# Altium project EverySync_AD.PrjPcb
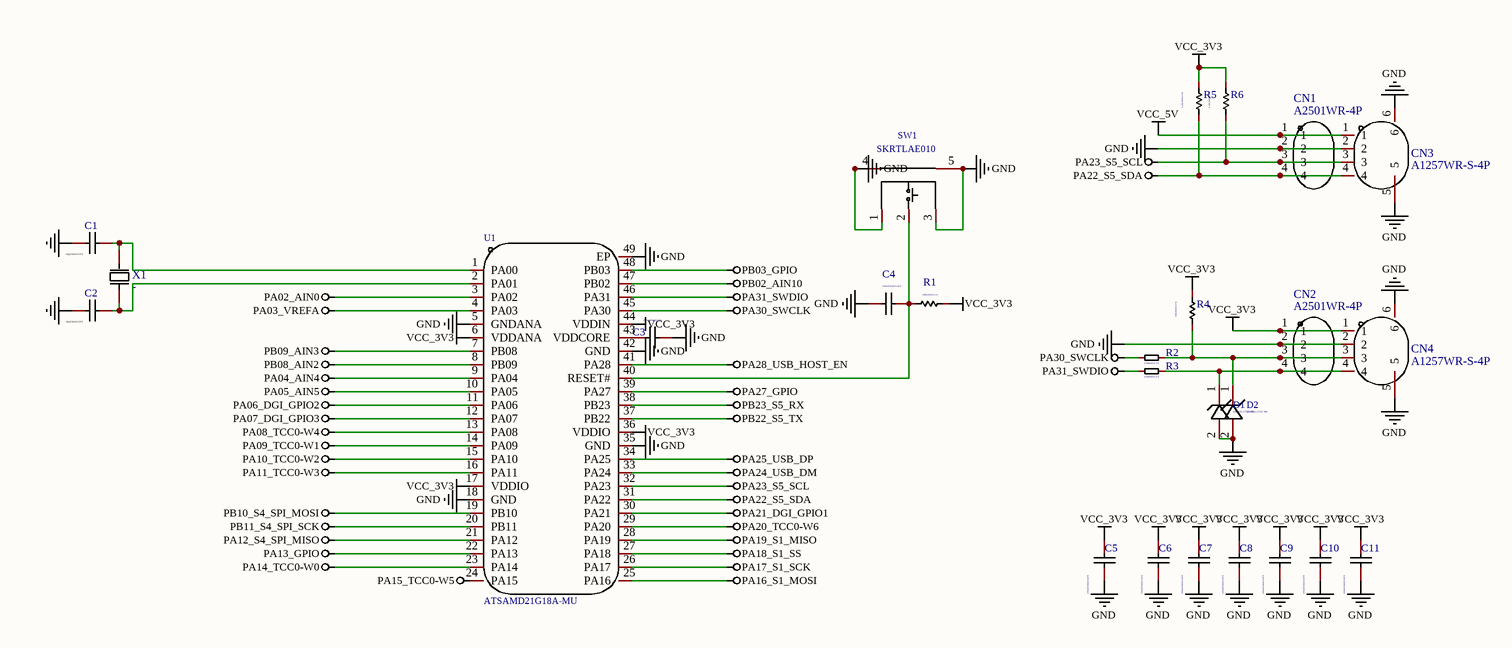
[diagram p0: 1_01 MCU.SchDoc.schdoc]
3 sheets, 155 parts. Net scope: flat (ports and power ports of the same name join across sheets).
Board file: EverySyncBoard.PcbDoc.pcbdoc
Sheets:
  1_01 MCU.SchDoc.schdoc
  2_02 Peripherals.SchDoc.schdoc
  3_03 Power.SchDoc.schdoc

## Sheet 1_01 MCU.SchDoc.schdoc
size 441 x 187 mm; Name: A_Customize; Symbol: A_Customize; Device: A_Customize; @Project Name: 01 MCU.SchDoc; REV: 1.0; Date: 2024-05-14; Sheet: 1/1; Draw By: TheConquerK; Company: NEU-REAL-LAB; Convert to PCB: yes; Add into BOM: yes; SheetNumber: 1; SheetTotal: 3

### Parts
C1  18pF/0402/50V  [C0402]  (value not drawn)
C2  18pF/0402/50V  [C0402]  (value not drawn)
C3  100nF/0603/50V  [C0402]
C4  100nF/0402/50V  [C0402]
C5  100nF/0603/50V  [C0402]
C6  100nF/0603/50V  [C0402]
C7  100nF/0603/50V  [C0402]
C8  100nF/0603/50V  [C0402]
C9  100nF/0603/50V  [C0402]
C10  100nF/0603/50V  [C0402]
C11  100nF/0603/50V  [C0402]
CN1  A2501WR-4P  [CONN-TH_A2501WR-4P]
CN2  A2501WR-4P  [CONN-TH_A2501WR-4P]
CN3  A1257WR-S-4P  [CONN-SMD_A1257WR-S-4P]
CN4  A1257WR-S-4P  [CONN-SMD_A1257WR-S-4P]
D1  ESD5Z3.3T1G-MS  [SOD-523]
D2  ESD5Z3.3T1G-MS  [SOD-523]
R1  10K/0402/1%  [R0402]
R2  22R/0402/1%  [R0402]
R3  22R/0402/1%  [R0402]
R4  10K/0402/1%  [R0402]
R5  2.2K/0402/1%  [R0402]
R6  2.2K/0402/1%  [R0402]
SW1  SKRTLAE010  [KEY-SMD_SKRTLAE010]
U1  ATSAMD21G18A-MU  [QFN-48_L7.0-W7.0-P0.50-TL-EP5.1]
X1  -  [OSC-SMD_L3.2-W1.5]

### Nets
GND: C1.2 C2.2 C3.2 C4.1 C5.2 C6.2 C7.2 C8.2 C9.2 C10.2 C11.2 CN1.2 CN2.2 CN3.2 CN3.5 CN3.6 CN4.2 CN4.5 CN4.6 D1.2(A) D2.2(A) SW1.1 SW1.3 SW1.4 SW1.5 U1.5(GNDANA) U1.18(GND) U1.35(GND) U1.42(GND) U1.49(EP)
PA02_AIN0: U1.3(PA02)
PA03_VREFA: U1.4(PA03)
PA04_AIN4: U1.9(PA04)
PA05_AIN5: U1.10(PA05)
PA06_DGI_GPIO2: U1.11(PA06)
PA07_DGI_GPIO3: U1.12(PA07)
PA08_TCC0-W4: U1.13(PA08)
PA09_TCC0-W1: U1.14(PA09)
PA10_TCC0-W2: U1.15(PA10)
PA11_TCC0-W3: U1.16(PA11)
PA12_S4_SPI_MISO: U1.21(PA12)
PA13_GPIO: U1.22(PA13)
PA14_TCC0-W0: U1.23(PA14)
PA15_TCC0-W5: U1.24(PA15)  [project net #EXPC1]
PA16_S1_MOSI: U1.25(PA16)
PA17_S1_SCK: U1.26(PA17)
PA18_S1_SS: U1.27(PA18)
PA19_S1_MISO: U1.28(PA19)
PA20_TCC0-W6: U1.29(PA20)  [project net #EXPC2]
PA21_DGI_GPIO1: U1.30(PA21)  [project net #EXPC3]
PA22_S5_SDA: CN1.4 CN3.4 R5.1 U1.31(PA22)
PA23_S5_SCL: CN1.3 CN3.3 R6.1 U1.32(PA23)
PA24_USB_DM: U1.33(PA24)
PA25_USB_DP: U1.34(PA25)
PA27_GPIO: U1.39(PA27)
PA28_USB_HOST_EN: U1.41(PA28)
PA30_SWCLK: R2.1 U1.45(PA30)
PA31_SWDIO: R3.1 U1.46(PA31)
PB02_AIN10: U1.47(PB02)
PB03_GPIO: U1.48(PB03)
PB08_AIN2: U1.8(PB09)
PB09_AIN3: U1.7(PB08)
PB10_S4_SPI_MOSI: U1.19(PB10)
PB11_S4_SPI_SCK: U1.20(PB11)
PB22_S5_TX: U1.37(PB22)
PB23_S5_RX: U1.38(PB23)
VCC_3V3: C5.1 C6.1 C7.1 C8.1 C9.1 C10.1 C11.1 CN2.1 CN4.1 R1.2 R4.2 R5.2 R6.2 U1.6(VDDANA) U1.17(VDDIO) U1.36(VDDIO) U1.44(VDDIN)
VCC_5V: CN1.1 CN3.1
NetC1_1: C1.1 U1.1(PA00) X1.2(OSC2)
NetC2_1: C2.1 U1.2(PA01) X1.1(OSC1)
NetC3_1: C3.1 U1.43(VDDCORE)
NetC4_2: C4.2 R1.1 SW1.2 U1.40(RESET#)
NetCN2_3: CN2.3 CN4.3 D2.1(C) R2.2 R4.1
NetCN2_4: CN2.4 CN4.4 D1.1(C) R3.2

### Notes on the sheet
- 1
- 2
- 3
- 4
- 5
- A
- B
- TITLE:
- 01 MCU.SchDoc
- REV:
- 1.0
- Date:
- Company:
- 2024-05-14
- NEU-REAL-LAB
- Drawn By:
- TheConquerK
- Sheet:
- 1/1

### Library data of the parts
C1 C2 = 18pF/0402/50V: Convert to PCB: yes; Name: 18pF/0402/50V; Symbol: 18pF/0402/50V; Device: 18pF/0402/50V; Published: 8-Jun-2000; LatestRevisionDate: 17-Jul-2002; LatestRevisionNote: Re-released for DXP Platform.; PackageReference: RAD-0.3; Publisher: Altium Limited; PackageDescription: Radial Cap, Thru-Hole; 2 Leads; 0.3 in Pin Spacing; Add into BOM: yes; Origin Footprint: C0402
C3 C5-C11 = 100nF/0603/50V: Convert to PCB: yes; Name: 100nF/0603/50V; Symbol: 100nF/0603/50V; Device: 100nF/0603/50V; Published: 8-Jun-2000; LatestRevisionDate: 17-Jul-2002; LatestRevisionNote: Re-released for DXP Platform.; PackageReference: RAD-0.3; Publisher: Altium Limited; PackageDescription: Radial Cap, Thru-Hole; 2 Leads; 0.3 in Pin Spacing; Add into BOM: yes; Origin Footprint: C0402
C4 = 100nF/0402/50V: Convert to PCB: yes; Name: 100nF/0402/50V; Symbol: 100nF/0402/50V; Device: 100nF/0402/50V; Published: 8-Jun-2000; LatestRevisionDate: 17-Jul-2002; LatestRevisionNote: Re-released for DXP Platform.; PackageReference: RAD-0.3; Publisher: Altium Limited; PackageDescription: Radial Cap, Thru-Hole; 2 Leads; 0.3 in Pin Spacing; Add into BOM: yes; Origin Footprint: C0402
CN1 CN2 = A2501WR-4P: Manufacturer: CJT(长江连接器); Convert to PCB: yes; Name: A2501WR-4P; Symbol: A2501WR-4P; Device: A2501WR-4P; Supplier: LCSC; Supplier Part: C225401; Manufacturer Part: A2501WR-4P; JLCPCB Part Class: Extended Part; Add into BOM: yes; Origin Footprint: CONN-TH_A2501WR-4P
CN3 CN4 = A1257WR-S-4P: Manufacturer: CJT(长江连接器); Convert to PCB: yes; Name: A1257WR-S-4P; Symbol: A1257WR-S-4P; Device: A1257WR-S-4P; Supplier: LCSC; Supplier Part: C225127; Manufacturer Part: A1257WR-S-4P; JLCPCB Part Class: Extended Part; Add into BOM: yes; Origin Footprint: CONN-SMD_A1257WR-S-4P
D1 D2 = ESD5Z3.3T1G-MS: Manufacturer: MDD（Microdiode Electronics）; Manufacturer Part: ESD5Z5V0; Convert to PCB: yes; Name: ESD5Z3.3T1G-MS; Symbol: ESD5Z3.3T1G-MS; Device: ESD5Z3.3T1G-MS; Supplier: LCSC; Supplier Part: C502546; JLCPCB Part Class: Extended Part; Add into BOM: yes; Origin Footprint: SOD-523
R1 R4 = 10K/0402/1%: Convert to PCB: yes; Name: 10K/0402/1%; Symbol: 10K/0402/1%; Device: 10K/0402/1%; Published: 8-Jun-2000; LatestRevisionDate: 17-Jul-2002; LatestRevisionNote: Re-released for DXP Platform.; PackageReference: AXIAL-0.5; Publisher: Altium Limited; PackageDescription: Axial Device, Thru-Hole; 2 Leads; 0.5 in Pin Spacing; Add into BOM: yes; Origin Footprint: R0402
R2 R3 = 22R/0402/1%: Convert to PCB: yes; Name: 22R/0402/1%; Symbol: 22R/0402/1%; Device: 22R/0402/1%; Add into BOM: yes; Origin Footprint: R0402
R5 R6 = 2.2K/0402/1%: Convert to PCB: yes; Name: 2.2K/0402/1%; Symbol: 2.2K/0402/1%; Device: 2.2K/0402/1%; Published: 8-Jun-2000; LatestRevisionDate: 17-Jul-2002; LatestRevisionNote: Re-released for DXP Platform.; PackageReference: AXIAL-0.5; Publisher: Altium Limited; PackageDescription: Axial Device, Thru-Hole; 2 Leads; 0.5 in Pin Spacing; Add into BOM: yes; Origin Footprint: R0402
SW1 = SKRTLAE010: Manufacturer: ALPS; Convert to PCB: yes; Name: SKRTLAE010; Symbol: SKRTLAE010; Device: SKRTLAE010; Supplier: LCSC; Manufacturer Part: SKRTLAE010; Supplier Part: C110293; JLCPCB Part Class: Extended Part; Add into BOM: yes; Origin Footprint: KEY-SMD_SKRTLAE010
U1 = ATSAMD21G18A-MU: Manufacturer: MICROCHIP(美国微芯); Convert to PCB: yes; Name: ATSAMD21G18A-MU; Symbol: ATSAMD21G18A-MU; Device: ATSAMD21G18A-MU; Supplier: LCSC; Supplier Part: C966903; Manufacturer Part: ATSAMD21G18A-MU; JLCPCB Part Class: Extended Part; Add into BOM: yes; Origin Footprint: QFN-48_L7.0-W7.0-P0.50-TL-EP5.1
X1 = -: Manufacturer: KDS(大真空); Manufacturer Part: DST310S 32.768KHz; Convert to PCB: yes; Name: -; Symbol: -; Device: -; Supplier: LCSC; Supplier Part: C93232; JLCPCB Part Class: Extended Part; Add into BOM: yes; Origin Footprint: OSC-SMD_L3.2-W1.5

## Sheet 2_02 Peripherals.SchDoc.schdoc
size 858 x 289 mm; Name: A_Customize; Symbol: A_Customize; Device: A_Customize; @Project Name: 02 Peripherals.SchDoc; REV: 1.0; Date: 2024-05-14; Sheet: 1/1; Draw By: TheConquerK; Company: NEU-REAL-LAB; Convert to PCB: yes; Add into BOM: yes
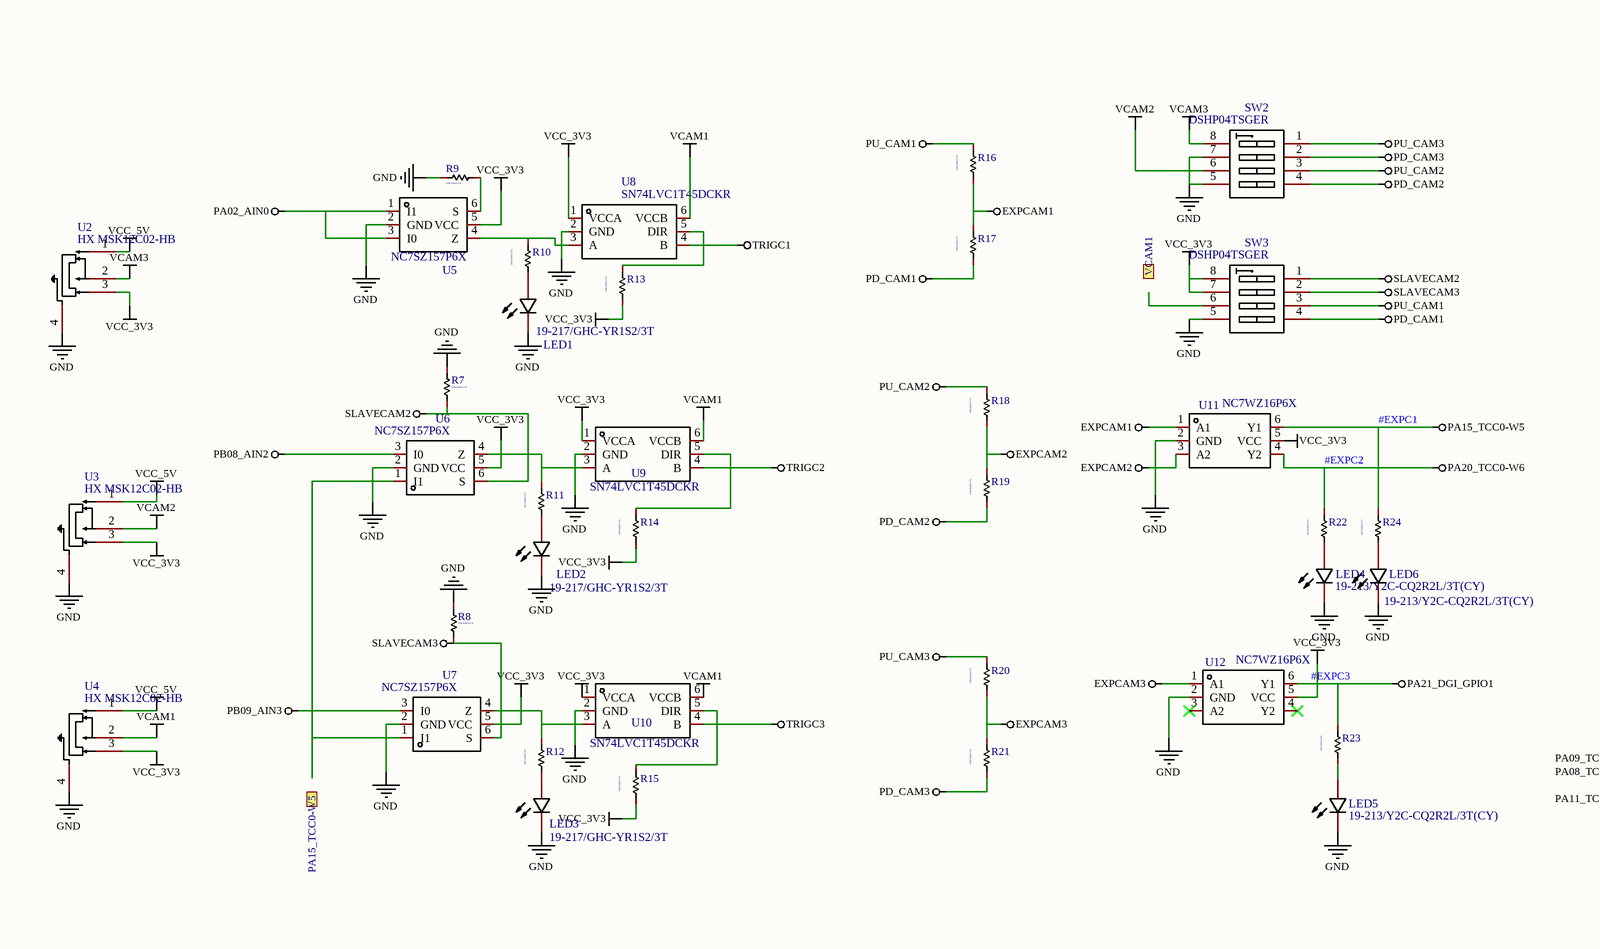
[diagram p1: 2_02 Peripherals.SchDoc.schdoc, left]
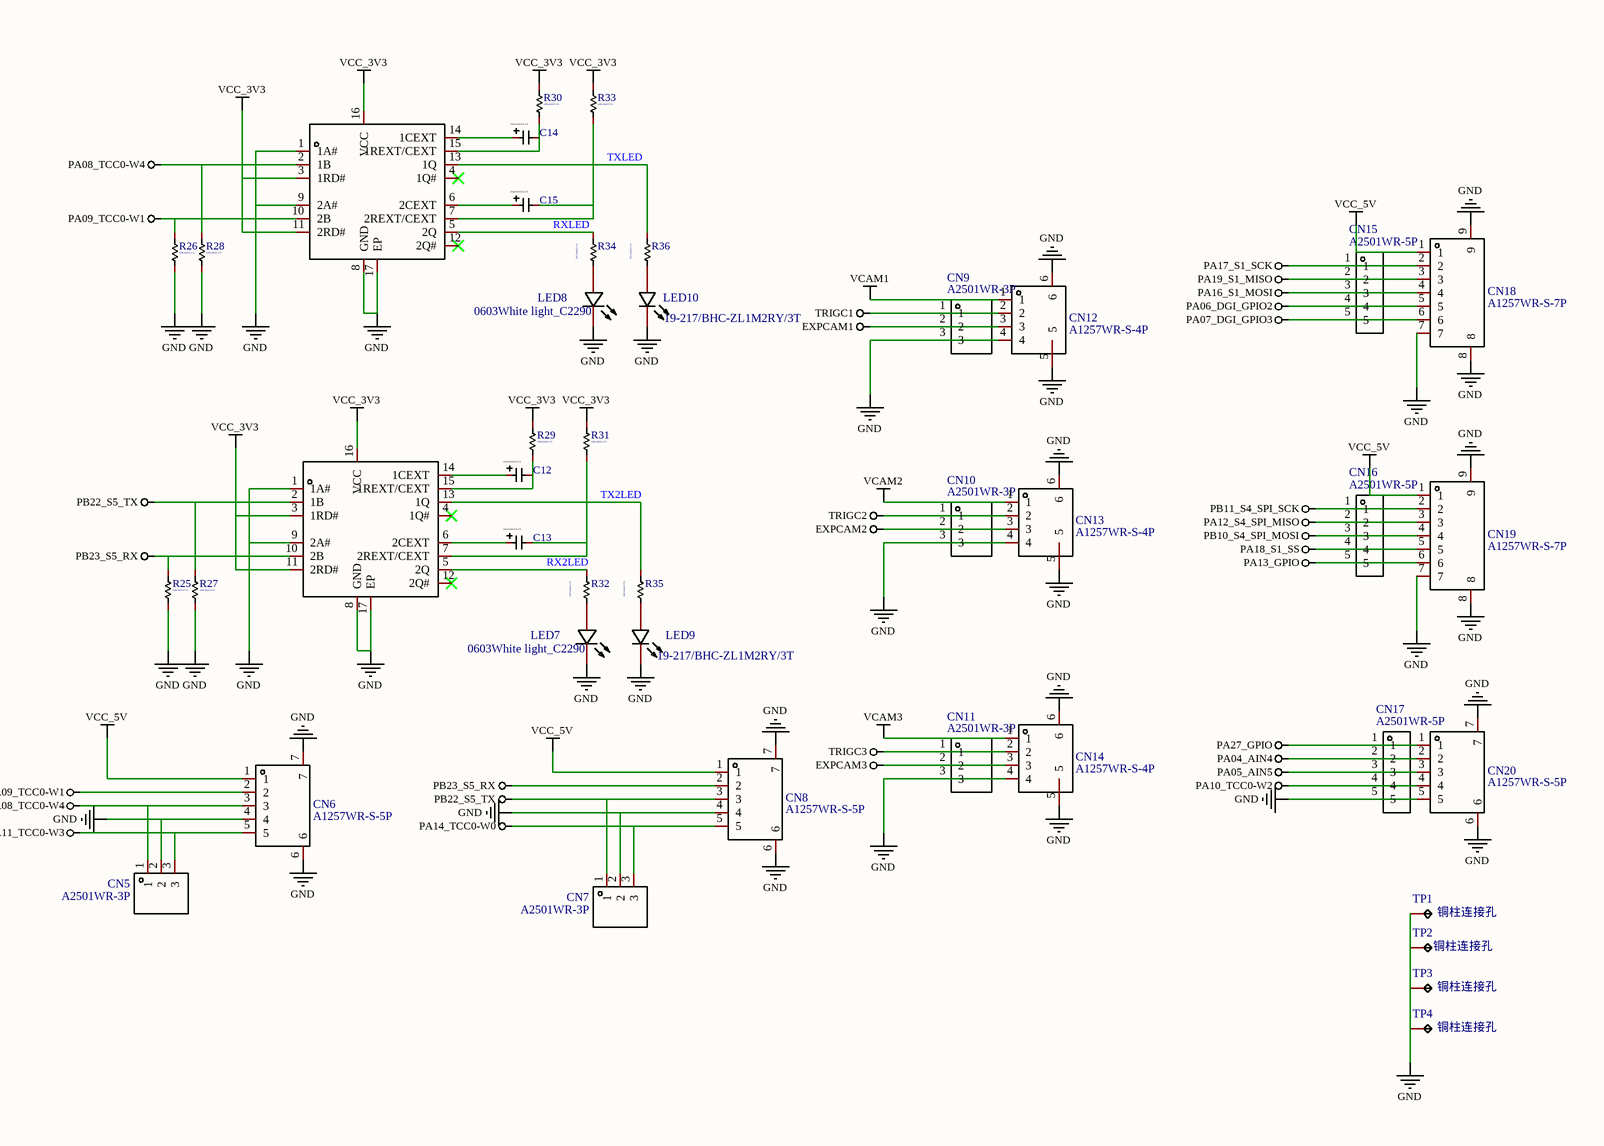
[diagram p2: 2_02 Peripherals.SchDoc.schdoc, right]

### Parts
C12  2.2u  [C0603]  (value not drawn)
C13  2.2u  [C0603]  (value not drawn)
C14  2.2u  [C0603]  (value not drawn)
C15  2.2u  [C0603]  (value not drawn)
CN5  A2501WR-3P  [CONN-TH_A2501WR-3P]
CN6  A1257WR-S-5P  [CONN-SMD_A1257WR-S-5P]
CN7  A2501WR-3P  [CONN-TH_A2501WR-3P]
CN8  A1257WR-S-5P  [CONN-SMD_A1257WR-S-5P]
CN9  A2501WR-3P  [CONN-TH_A2501WR-3P]
CN10  A2501WR-3P  [CONN-TH_A2501WR-3P]
CN11  A2501WR-3P  [CONN-TH_A2501WR-3P]
CN12  A1257WR-S-4P  [CONN-SMD_A1257WR-S-4P]
CN13  A1257WR-S-4P  [CONN-SMD_A1257WR-S-4P]
CN14  A1257WR-S-4P  [CONN-SMD_A1257WR-S-4P]
CN15  A2501WR-5P  [CONN-TH_A2501WR-5P]
CN16  A2501WR-5P  [CONN-TH_A2501WR-5P]
CN17  A2501WR-5P  [CONN-TH_A2501WR-5P]
CN18  A1257WR-S-7P  [CONN-SMD_A1257WR-S-7P]
CN19  A1257WR-S-7P  [CONN-SMD_A1257WR-S-7P]
CN20  A1257WR-S-5P  [CONN-SMD_A1257WR-S-5P]
LED1  19-217/GHC-YR1S2/3T  [LED0603-RD]
LED2  19-217/GHC-YR1S2/3T  [LED0603-RD]
LED3  19-217/GHC-YR1S2/3T  [LED0603-RD]
LED4  19-213/Y2C-CQ2R2L/3T(CY)  [LED0603-RD-YELLOW]
LED5  19-213/Y2C-CQ2R2L/3T(CY)  [LED0603-RD-YELLOW]
LED6  19-213/Y2C-CQ2R2L/3T(CY)  [LED0603-RD-YELLOW]
LED7  0603White light_C2290  [LED0603-R-RD_WHITE]
LED8  0603White light_C2290  [LED0603-R-RD_WHITE]
LED9  19-217/BHC-ZL1M2RY/3T  [LED0603-FD_BLUE]
LED10  19-217/BHC-ZL1M2RY/3T  [LED0603-FD_BLUE]
R7  10K/0402/1%  [R0402]
R8  10K/0402/1%  [R0402]
R9  10K/0402/1%  [R0402]
R10  2K2/0402/1%  [R0402]
R11  2K2/0402/1%  [R0402]
R12  2K2/0402/1%  [R0402]
R13  10K/0402/1%  [R0402]
R14  10K/0402/1%  [R0402]
R15  10K/0402/1%  [R0402]
R16  10K/0402/1%  [R0402]
R17  10K/0402/1%  [R0402]
R18  10K/0402/1%  [R0402]
R19  10K/0402/1%  [R0402]
R20  10K/0402/1%  [R0402]
R21  10K/0402/1%  [R0402]
R22  2K2/0402/1%  [R0402]
R23  2K2/0402/1%  [R0402]
R24  2K2/0402/1%  [R0402]
R25  10K/0402/1%  [R0402]
R26  10K/0402/1%  [R0402]
R27  10K/0402/1%  [R0402]
R28  10K/0402/1%  [R0402]
R29  10K/0402/1%  [R0402]
R30  10K/0402/1%  [R0402]
R31  10K/0402/1%  [R0402]
R32  2K2/0402/1%  [R0402]
R33  10K/0402/1%  [R0402]
R34  2K2/0402/1%  [R0402]
R35  2K2/0402/1%  [R0402]
R36  2K2/0402/1%  [R0402]
SW2  DSHP04TSGER  [SW-SMD_8P-L6.7-W5.4-P1.27-LS8.4]
SW3  DSHP04TSGER  [SW-SMD_8P-L6.7-W5.4-P1.27-LS8.4]
TP1  铜柱连接孔  [3MM铜柱孔]
TP2  铜柱连接孔  [3MM铜柱孔]
TP3  铜柱连接孔  [3MM铜柱孔]
TP4  铜柱连接孔  [3MM铜柱孔]
U2  HX MSK12C02-HB  [SW-SMD_MSK12C02-HB]
U3  HX MSK12C02-HB  [SW-SMD_MSK12C02-HB]
U4  HX MSK12C02-HB  [SW-SMD_MSK12C02-HB]
U5  NC7SZ157P6X  [SC-70-6_L2.0-W1.3-P0.65-LS2.1-BR]
U6  NC7SZ157P6X  [SC-70-6_L2.0-W1.3-P0.65-LS2.1-BR]
U7  NC7SZ157P6X  [SC-70-6_L2.0-W1.3-P0.65-LS2.1-BR]
U8  SN74LVC1T45DCKR  [SC-70-6_L2.2-W1.3-P0.65-LS2.2-BR]
U9  SN74LVC1T45DCKR  [SC-70-6_L2.2-W1.3-P0.65-LS2.2-BR]
U10  SN74LVC1T45DCKR  [SC-70-6_L2.2-W1.3-P0.65-LS2.2-BR]
U11  NC7WZ16P6X  [SC-70-6_L2.2-W1.3-P0.65-LS2.1-BR]
U12  NC7WZ16P6X  [SC-70-6_L2.2-W1.3-P0.65-LS2.1-BR]
U13  74AHC123ABQ,115  [74AHC123ABQ,115]  (value not drawn)
U14  74AHC123ABQ,115  [74AHC123ABQ,115]  (value not drawn)

### Ports
PA15_TCC0-W5 (out), VCAM1 (out)

### Nets
#EXPC1: R24.2 U11.6(Y1)  [also labelled PA15_TCC0-W5]
#EXPC2: R22.2 U11.4(Y2)  [also labelled PA20_TCC0-W6]
#EXPC3: R23.2 U12.6(Y1)  [also labelled PA21_DGI_GPIO1]
EXPCAM1: CN9.2 CN12.3 R16.1 R17.2 U11.1(A1)
EXPCAM2: CN10.2 CN13.3 R18.1 R19.2 U11.3(A2)
EXPCAM3: CN11.2 CN14.3 R20.1 R21.2 U12.1(A1)
GND: CN5.2 CN6.4 CN6.6 CN6.7 CN7.2 CN8.4 CN8.6 CN8.7 CN9.3 CN10.3 CN11.3 CN12.4 CN12.5 CN12.6 CN13.4 CN13.5 CN13.6 CN14.4 CN14.5 CN14.6 CN17.5 CN18.7 CN18.8 CN18.9 CN19.7 CN19.8 CN19.9 CN20.5 CN20.6 CN20.7 LED1.1(C) LED2.1(C) LED3.1(C) LED4.1(C) LED5.1(C) LED6.1(C) LED7.2(K) LED8.2(K) LED9.1(C) LED10.1(C) R7.2 R8.2 R9.2 R25.1 R26.1 R27.1 R28.1 SW2.5(B4) SW2.7(B2) SW3.5(B4) TP1.1 TP2.1 TP3.1 TP4.1 U2.4 U3.4 U4.4 U5.2(GND) U6.2(GND) U7.2(GND) U8.2(GND) U9.2(GND) U10.2(GND) U11.2(GND) U12.2(GND) U13.1(1A#) U13.8(GND) U13.9(2A#) U13.17(EP) U14.1(1A#) U14.8(GND) U14.9(2A#) U14.17(EP)
PA02_AIN0: U5.1(I1) U5.3(I0)
PA04_AIN4: CN17.2 CN20.2
PA05_AIN5: CN17.3 CN20.3
PA06_DGI_GPIO2: CN15.4 CN18.5
PA07_DGI_GPIO3: CN15.5 CN18.6
PA08_TCC0-W4: CN5.1 CN6.3 R28.2 U14.2(1B)
PA09_TCC0-W1: CN6.2 R26.2 U14.10(2B)
PA10_TCC0-W2: CN17.4 CN20.4
PA11_TCC0-W3: CN5.3 CN6.5
PA12_S4_SPI_MISO: CN16.2 CN19.3
PA13_GPIO: CN16.5 CN19.6
PA14_TCC0-W0: CN7.3 CN8.5
PA16_S1_MOSI: CN15.3 CN18.4
PA17_S1_SCK: CN15.1 CN18.2
PA18_S1_SS: CN16.4 CN19.5
PA19_S1_MISO: CN15.2 CN18.3
PA27_GPIO: CN17.1 CN20.1
PB08_AIN2: U6.3(I0)
PB09_AIN3: U7.3(I0)
PB10_S4_SPI_MOSI: CN16.3 CN19.4
PB11_S4_SPI_SCK: CN16.1 CN19.2
PB22_S5_TX: CN7.1 CN8.3 R27.2 U13.2(1B)
PB23_S5_RX: CN8.2 R25.2 U13.10(2B)
PD_CAM1: R17.1 SW3.4(A4)
PD_CAM2: R19.1 SW2.4(A4)
PD_CAM3: R21.1 SW2.2(A2)
PU_CAM1: R16.2 SW3.3(A3)
PU_CAM2: R18.2 SW2.3(A3)
PU_CAM3: R20.2 SW2.1(A1)
SLAVECAM2: R7.1 SW3.1(A1) U6.6(S)
SLAVECAM3: R8.1 SW3.2(A2) U7.6(S)
TRIGC1: CN9.1 CN12.2 U8.4(B)
TRIGC2: CN10.1 CN13.2 U9.4(B)
TRIGC3: CN11.1 CN14.2 U10.4(B)
VCAM1: CN12.1 U4.2 U8.6(VCCB) U9.6(VCCB) U10.6(VCCB)
VCAM2: CN13.1 SW2.6(B3) U3.2
VCAM3: CN14.1 SW2.8(B1) U2.2
VCC_3V3: R13.1 R14.1 R15.1 R29.2 R30.2 R31.2 R33.2 SW3.7(B2) SW3.8(B1) U2.3 U3.3 U4.3 U5.5(VCC) U6.5(VCC) U7.5(VCC) U8.1(VCCA) U9.1(VCCA) U10.1(VCCA) U11.5(VCC) U12.5(VCC) U13.3(1RD#) U13.11(2RD#) U13.16(VCC) U14.3(1RD#) U14.11(2RD#) U14.16(VCC)
VCC_5V: CN6.1 CN8.1 CN18.1 CN19.1 U2.1 U3.1 U4.1
RX2LED: R32.2 U13.5(2Q)
RXLED: R34.2 U14.5(2Q)
TX2LED: R35.2 U13.13(1Q)
TXLED: R36.2 U14.13(1Q)
NetC12_1: C12.1 U13.14(1CEXT)
NetC12_2: C12.2 R29.1 U13.15(1REXT/CEXT)
NetC13_1: C13.1 U13.6(2CEXT)
NetC13_2: C13.2 R31.1 U13.7(2REXT/CEXT)
NetC14_1: C14.1 U14.14(1CEXT)
NetC14_2: C14.2 R30.1 U14.15(1REXT/CEXT)
NetC15_1: C15.1 U14.6(2CEXT)
NetC15_2: C15.2 R33.1 U14.7(2REXT/CEXT)
NetLED1_2: LED1.2(A) R10.1
NetLED2_2: LED2.2(A) R11.1
NetLED3_2: LED3.2(A) R12.1
NetLED4_2: LED4.2(A) R22.1
NetLED5_2: LED5.2(A) R23.1
NetLED6_2: LED6.2(A) R24.1
NetLED7_1: LED7.1(A) R32.1
NetLED8_1: LED8.1(A) R34.1
NetLED9_2: LED9.2(A) R35.1
NetLED10_2: LED10.2(A) R36.1
NetR9_1: R9.1 U5.6(S)
NetR10_2: R10.2 U5.4(Z) U8.3(A)
NetR11_2: R11.2 U6.4(Z) U9.3(A)
NetR12_2: R12.2 U7.4(Z) U10.3(A)
NetR13_2: R13.2 U8.5(DIR)
NetR14_2: R14.2 U9.5(DIR)
NetR15_2: R15.2 U10.5(DIR)
NetU6_1: U6.1(I1) U7.1(I1)

Not connected (* = marked no-connect by the designer): SW3 6(B3); U12 3(A2)* 4(Y2)*; U13 4(1Q#)* 12(2Q#)*; U14 4(1Q#)* 12(2Q#)*

### Notes on the sheet
- 1
- 2
- 3
- 4
- 5
- 6
- 7
- 8
- 9
- 10
- 11
- 12
- A
- B
- C
- D
- TITLE:
- 02 Peripherals.SchDoc
- REV:
- 1.0
- Date:
- Company:
- 2024-05-14
- NEU-REAL-LAB
- Drawn By:
- TheConquerK
- Sheet:
- 1/1
- (in symbol 2.2u) 10uF/0603/6.3V

### Library data of the parts
C12-C15 = 2.2u: Convert to PCB: yes; Name: 2.2u; Symbol: 2.2u; Device: 2.2u; Add into BOM: yes; Origin Footprint: C0603
CN5 CN7 CN9-CN11 = A2501WR-3P: Manufacturer: CJT(长江连接器); Convert to PCB: yes; Name: A2501WR-3P; Symbol: A2501WR-3P; Device: A2501WR-3P; Supplier: LCSC; Supplier Part: C225400; Manufacturer Part: A2501WR-3P; JLCPCB Part Class: Extended Part; Add into BOM: yes; Origin Footprint: CONN-TH_A2501WR-3P
CN6 CN8 CN20 = A1257WR-S-5P: Manufacturer: CJT(长江连接器); Convert to PCB: yes; Name: A1257WR-S-5P; Symbol: A1257WR-S-5P; Device: A1257WR-S-5P; Supplier: LCSC; Supplier Part: C225128; Manufacturer Part: A1257WR-S-5P; JLCPCB Part Class: Extended Part; Add into BOM: yes; Origin Footprint: CONN-SMD_A1257WR-S-5P
CN12-CN14 = A1257WR-S-4P: as CN3 on sheet 1_01 MCU.SchDoc; Name: A1257WR-S-4P; Symbol: A1257WR-S-4P; Device: A1257WR-S-4P; Supplier: LCSC; Supplier Part: C225127; Manufacturer Part: A1257WR-S-4P; JLCPCB Part Class: Extended Part; Add into BOM: yes; Origin Footprint: CONN-SMD_A1257WR-S-4P
CN15-CN17 = A2501WR-5P: Manufacturer: CJT(长江连接器); Convert to PCB: yes; Name: A2501WR-5P; Symbol: A2501WR-5P; Device: A2501WR-5P; Supplier: LCSC; Supplier Part: C225402; Manufacturer Part: A2501WR-5P; JLCPCB Part Class: Extended Part; Add into BOM: yes; Origin Footprint: CONN-TH_A2501WR-5P
CN18 CN19 = A1257WR-S-7P: Manufacturer: CJT(长江连接器); Convert to PCB: yes; Name: A1257WR-S-7P; Symbol: A1257WR-S-7P; Device: A1257WR-S-7P; Supplier: LCSC; Supplier Part: C225130; Manufacturer Part: A1257WR-S-7P; JLCPCB Part Class: Extended Part; Add into BOM: yes; Origin Footprint: CONN-SMD_A1257WR-S-7P
LED1-LED3 = 19-217/GHC-YR1S2/3T: Manufacturer: EVERLIGHT(亿光); Convert to PCB: yes; Name: 19-217/GHC-YR1S2/3T; Symbol: 19-217/GHC-YR1S2/3T; Device: 19-217/GHC-YR1S2/3T; Supplier: LCSC; Manufacturer Part: 19-217/GHC-YR1S2/3T; Supplier Part: C72043; JLCPCB Part Class: Basic Part; Add into BOM: yes; Origin Footprint: LED0603-RD
LED4-LED6 = 19-213/Y2C-CQ2R2L/3T(CY): Manufacturer: EVERLIGHT(亿光); Convert to PCB: yes; Name: 19-213/Y2C-CQ2R2L/3T(CY); Symbol: 19-213/Y2C-CQ2R2L/3T(CY); Device: 19-213/Y2C-CQ2R2L/3T(CY); Supplier: LCSC; Manufacturer Part: 19-213/Y2C-CQ2R2L/3T(CY); Supplier Part: C72038; JLCPCB Part Class: Basic Part; Add into BOM: yes; Origin Footprint: LED0603-RD-YELLOW
LED7 LED8 = 0603White light_C2290: Manufacturer: KENTO; Manufacturer Part: KT-0603白灯; Convert to PCB: yes; Name: 0603White light_C2290; Symbol: 0603White light_C2290; Device: 0603White light_C2290; Supplier: LCSC; Supplier Part: C2290; JLCPCB Part Class: Basic Part; Add into BOM: yes; Origin Footprint: LED0603-R-RD_WHITE
LED9 LED10 = 19-217/BHC-ZL1M2RY/3T: Manufacturer: EVERLIGHT(亿光); Convert to PCB: yes; Name: 19-217/BHC-ZL1M2RY/3T; Symbol: 19-217/BHC-ZL1M2RY/3T; Device: 19-217/BHC-ZL1M2RY/3T; Supplier: LCSC; Manufacturer Part: 19-217/BHC-ZL1M2RY/3T; Supplier Part: C72041; JLCPCB Part Class: Basic Part; Add into BOM: yes; Origin Footprint: LED0603-FD_BLUE
R7-R9 R13-R21 R25-R31 R33 = 10K/0402/1%: Convert to PCB: yes; Name: 10K/0402/1%; Symbol: 10K/0402/1%; Device: 10K/0402/1%; Published: 8-Jun-2000; LatestRevisionDate: 17-Jul-2002; LatestRevisionNote: Re-released for DXP Platform.; PackageReference: AXIAL-0.5; Publisher: Altium Limited; PackageDescription: Axial Device, Thru-Hole; 2 Leads; 0.5 in Pin Spacing; Add into BOM: yes; Origin Footprint: R0402
R10-R12 R22-R24 R32 R34-R36 = 2K2/0402/1%: Convert to PCB: yes; Name: 2K2/0402/1%; Symbol: 2K2/0402/1%; Device: 2K2/0402/1%; Published: 8-Jun-2000; LatestRevisionDate: 17-Jul-2002; LatestRevisionNote: Re-released for DXP Platform.; PackageReference: AXIAL-0.5; Publisher: Altium Limited; PackageDescription: Axial Device, Thru-Hole; 2 Leads; 0.5 in Pin Spacing; Add into BOM: yes; Origin Footprint: R0402
SW2 SW3 = DSHP04TSGER: Manufacturer: YE; Manufacturer Part: DSHP04TSGET; Convert to PCB: yes; Name: DSHP04TSGER; Symbol: DSHP04TSGER; Device: DSHP04TSGER; Supplier: LCSC; Supplier Part: C40736; JLCPCB Part Class: Extended Part; Add into BOM: yes; Origin Footprint: SW-SMD_8P-L6.7-W5.4-P1.27-LS8.4
TP1-TP4 = 铜柱连接孔: Manufacturer: Keystone; Manufacturer Part: 6037; Convert to PCB: yes; Name: 铜柱连接孔; Symbol: 铜柱连接孔; Device: 铜柱连接孔; Supplier: LCSC; Supplier Part: C238145; Add into BOM: yes; Origin Footprint: 3MM铜柱孔
U2-U4 = HX MSK12C02-HB: Manufacturer: hanxia(韩下); Convert to PCB: yes; Name: HX MSK12C02-HB; Symbol: HX MSK12C02-HB; Device: HX MSK12C02-HB; Supplier: LCSC; Supplier Part: C5149817; Manufacturer Part: HX MSK12C02-HB; link: https://atta.szlcsc.com/upload/public/pdf/source/20220907/9FFF0EFCC2FB5829D7D0DE0DF6E27CCE.pdf; JLCPCB Part Class: Extended Part; Add into BOM: yes; Origin Footprint: SW-SMD_MSK12C02-HB
U5-U7 = NC7SZ157P6X: Manufacturer: onsemi(安森美); Convert to PCB: yes; Name: NC7SZ157P6X; Symbol: NC7SZ157P6X; Device: NC7SZ157P6X; Supplier: LCSC; Supplier Part: C77686; Manufacturer Part: NC7SZ157P6X; JLCPCB Part Class: Extended Part; Add into BOM: yes; Origin Footprint: SC-70-6_L2.0-W1.3-P0.65-LS2.1-BR
U8-U10 = SN74LVC1T45DCKR: Manufacturer: TI(德州仪器); Convert to PCB: yes; Name: SN74LVC1T45DCKR; Symbol: SN74LVC1T45DCKR; Device: SN74LVC1T45DCKR; Supplier: LCSC; Manufacturer Part: SN74LVC1T45DCKR; Supplier Part: C9382; JLCPCB Part Class: Extended Part; Add into BOM: yes; Origin Footprint: SC-70-6_L2.2-W1.3-P0.65-LS2.2-BR
U11 U12 = NC7WZ16P6X: Manufacturer: onsemi(安森美); Convert to PCB: yes; Name: NC7WZ16P6X; Symbol: NC7WZ16P6X; Device: NC7WZ16P6X; Supplier: LCSC; Supplier Part: C114148; Manufacturer Part: NC7WZ16P6X; JLCPCB Part Class: Extended Part; Add into BOM: yes; Origin Footprint: SC-70-6_L2.2-W1.3-P0.65-LS2.1-BR
U13 U14 = 74AHC123ABQ,115: Manufacturer: Nexperia(安世); Add into BOM: yes; Logic Family: 74AHC; Logic Gate Type: 单稳态; Number Of Channels: 2; Schmidt trigger input: 否; propagation delay: 5.1ns; Current-OutputLow: 8mA; Supply Voltage: 2V5.5V; Origin Footprint: DHVQFN-16_L3.5-W2.5-P0.50-BL-EP; Name: 74AHC123ABQ,115; Symbol: 74AHC123ABQ,115; Device: 74AHC123ABQ,115; LCSC Part Name: 74AHC123ABQ,115; Supplier Part: C554211; Manufacturer Part: 74AHC123ABQ,115; Supplier Footprint: DHVQFN-16; JLCPCB Part Class: Extended Part; Datasheet: https://atta.szlcsc.com/upload/public/pdf/source/20171113/C87362_15105616511311116138.pdf; Supplier: LCSC; Convert to PCB: yes; Current-OutputHigh: 8mA; OperatingTemperature: -40℃+125℃

## Sheet 3_03 Power.SchDoc.schdoc
size 497 x 243 mm; Name: A_A4; Symbol: A_A4; Device: A_A4; @Project Name: 03 Power.SchDoc; REV: 1.0; Date: 2024-05-14; Sheet: 1/1; Draw By: TheConquerK; Company: NEU-REAL-LAB; Convert to PCB: yes; Add into BOM: yes
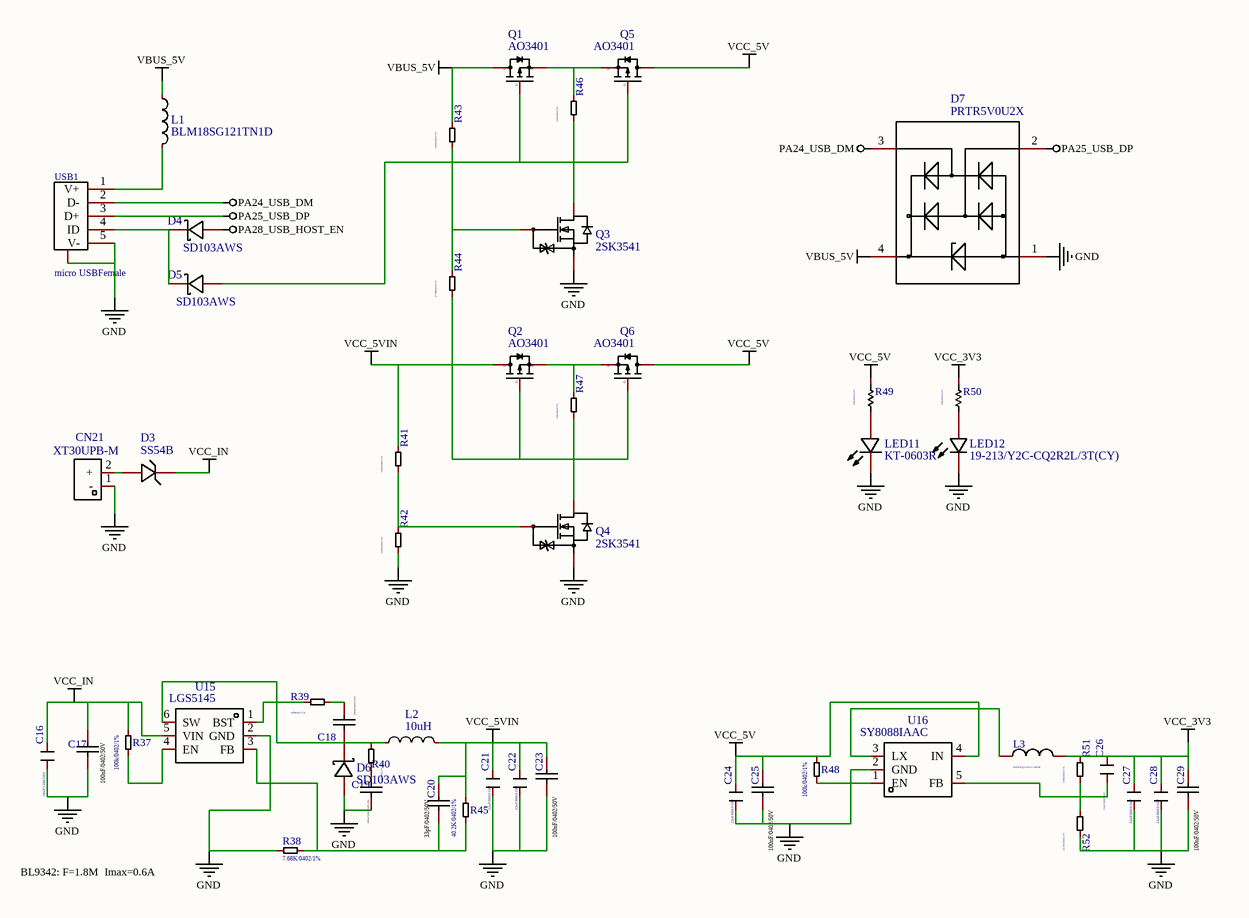
[diagram p3: 3_03 Power.SchDoc.schdoc]

### Parts
C16  10uF/1206/50V  [C1206]
C17  100nF/0603/50V  [C0402]  (value not drawn)
C18  100nF/0603/50V  [C0402]  (value not drawn)
C19  100nF/0603/50V  [C0402]  (value not drawn)
C20  100nF/0603/50V  [R0402]  (value not drawn)
C21  22uF/0603/10V  [C0603]
C22  22uF/0603/10V  [C0603]
C23  100nF/0603/50V  [C0402]  (value not drawn)
C24  22uF/0603/10V  [C0603]
C25  100nF/0603/50V  [C0402]  (value not drawn)
C26  22pF/0402/50V  [C0402]
C27  22uF/0603/10V  [C0603]
C28  22uF/0603/10V  [C0603]
C29  100nF/0603/50V  [C0402]  (value not drawn)
CN21  XT30UPB-M  [CONN-TH_XT30UPB-M]
D3  SS54B  [DO-214BA_L4.8-W2.9-LS5.3-RD]
D4  SD103AWS  [SOD-323_L1.8-W1.3-LS2.5-RD]
D5  SD103AWS  [SOD-323_L1.8-W1.3-LS2.5-RD]
D6  SD103AWS  [SOD-323_L1.8-W1.3-LS2.5-RD]
D7  PRTR5V0U2X  [SOT-143_L2.9-W1.3-P1.92-LS2.3-BL]
L1  BLM18SG121TN1D  [L0603]
L2  10uH  [L1008]
L3  PSPNAQ252012-2R2M  [L2520]
LED11  KT-0603R  [LED0603-RD]
LED12  19-213/Y2C-CQ2R2L/3T(CY)  [LED0603-RD-YELLOW]
Q1  AO3401  [SOT-23-3_L2.9-W1.3-P1.90-LS2.4-BR]
Q2  AO3401  [SOT-23-3_L2.9-W1.3-P1.90-LS2.4-BR]
Q3  2SK3541  [SOT-723_L1.2-W0.8-P0.40-LS1.2-BR]
Q4  2SK3541  [SOT-723_L1.2-W0.8-P0.40-LS1.2-BR]
Q5  AO3401  [SOT-23-3_L2.9-W1.3-P1.90-LS2.4-BR]
Q6  AO3401  [SOT-23-3_L2.9-W1.3-P1.90-LS2.4-BR]
R37  100k/0402/1%  [R0402]
R38  7.68K/0402/1%  [R0402]
R39  10R/0402/1%  [R0402]
R40  10R/0402/1%-NC  [R0402]
R41  100k/0402/1%  [R0402]
R42  100k/0402/1%  [R0402]
R43  100k/0402/1%  [R0402]
R44  470R/0402/1%  [R0402]
R45  40.2K/0402/1%  [R0402]
R46  10k/0402/1%  [R0402]
R47  10k/0402/1%  [R0402]
R48  100k/0402/1%  [R0402]
R49  10K/0402/1%  [R0402]
R50  10K/0402/1%  [R0402]
R51  100k/0402/1%  [R0402]
R52  22.1K/0402/1%  [R0402]
U15  LGS5145  [SOT-23-6_L2.9-W1.7-P0.95-LS2.8-BL]
U16  SY8088IAAC  [SOT-23-5_L3.0-W1.7-P0.95-LS2.8-BL]
USB1  micro USBFemale  [MICRO-USB-SMD_5P-P0.65-H-F_C10418]

### Nets
GND: C16.1 C17.1 C19.1 C21.1 C22.1 C23.1 C24.1 C25.1 C27.1 C28.1 C29.1 CN21.1(-) D6.2(A) D7.1(GND) LED11.1(K) LED12.1(C) Q3.2(S) Q4.2(S) R38.2 R42.1 R52.1 U15.2(GND) U16.2(GND) USB1.5(MTN)
PA24_USB_DM: D7.3(IO2) USB1.2(D-)
PA25_USB_DP: D7.2(IO1) USB1.3(D+)
PA28_USB_HOST_EN: D4.2(A)
VBUS_5V: D7.4(VCC) L1.1 Q1.3(D) R43.2
VCC_3V3: C26.2 C27.2 C28.2 C29.2 L3.2 R50.2 R51.2
VCC_5V: C24.2 C25.2 Q5.3(D) Q6.3(D) R48.2 R49.2 U16.4(IN)
VCC_5VIN: C20.2 C21.2 C22.2 C23.2 L2.2 Q2.3(D) R41.2 R45.2
VCC_IN: C16.2 C17.2 D3.1(C) R37.2 U15.5(VIN)
NetC18_1: C18.1 D6.1(K) L2.1 R40.2 U15.6(SW)
NetC18_2: C18.2 R39.2
NetC19_2: C19.2 R40.1
NetC20_1: C20.1 R38.1 R45.1 U15.3(FB)
NetC26_1: C26.1 R51.1 R52.2 U16.5(FB)
NetCN21_2: CN21.2(+) D3.2(A)
NetD4_1: D4.1(K) D5.1(K) USB1.4(ID)
NetD5_2: D5.2(A) Q1.1(G) Q3.3(D) Q5.1(G) R46.1
NetL1_2: L1.2 USB1.1(V+)
NetL3_1: L3.1 U16.3(LX)
NetLED11_2: LED11.2(A) R49.1
NetLED12_2: LED12.2(A) R50.1
NetQ1_2: Q1.2(S) Q5.2(S) R46.2
NetQ2_1: Q2.1(G) Q4.3(D) Q6.1(G) R44.1 R47.1
NetQ2_2: Q2.2(S) Q6.2(S) R47.2
NetQ3_1: Q3.1(G) R43.1 R44.2
NetQ4_1: Q4.1(G) R41.1 R42.2
NetR37_1: R37.1 U15.4(EN)
NetR39_1: R39.1 U15.1(BST)
NetR48_1: R48.1 U16.1(EN)

### Notes on the sheet
- BL9342: F=1.8M  Imax=0.6A
- 1
- 2
- 3
- 4
- 5
- A
- B
- C
- D
- TITLE:
- 03 Power.SchDoc
- REV:
- 1.0
- Date:
- Company:
- 2024-05-14
- NEU-REAL-LAB
- Drawn By:
- TheConquerK
- Sheet:
- 1/1
- (in symbol 100nF/0603/50V) 100nF/0402/50V; 100nF/0402/50V-NC; 33pF/0402/50V

### Library data of the parts
C16 = 10uF/1206/50V: Convert to PCB: yes; Name: 10uF/1206/50V; Symbol: 10uF/1206/50V; Device: 10uF/1206/50V; Add into BOM: yes; Origin Footprint: C1206
C17-C20 C23 C25 C29 = 100nF/0603/50V: Convert to PCB: yes; Name: 100nF/0603/50V; Symbol: 100nF/0603/50V; Device: 100nF/0603/50V; Published: 8-Jun-2000; LatestRevisionDate: 17-Jul-2002; LatestRevisionNote: Re-released for DXP Platform.; PackageReference: RAD-0.3; Publisher: Altium Limited; PackageDescription: Radial Cap, Thru-Hole; 2 Leads; 0.3 in Pin Spacing; Add into BOM: yes
  C17-C19 C23 C25 C29: Origin Footprint: C0402
  C20: Origin Footprint: R0402
C21 C22 C24 C27 C28 = 22uF/0603/10V: Convert to PCB: yes; Name: 22uF/0603/10V; Symbol: 22uF/0603/10V; Device: 22uF/0603/10V; Add into BOM: yes; Origin Footprint: C0603
C26 = 22pF/0402/50V: Convert to PCB: yes; Name: 22pF/0402/50V; Symbol: 22pF/0402/50V; Device: 22pF/0402/50V; Add into BOM: yes; Origin Footprint: C0402
CN21 = XT30UPB-M: Manufacturer: AMASS(艾迈斯); Convert to PCB: yes; Name: XT30UPB-M; Symbol: XT30UPB-M; Device: XT30UPB-M; Supplier: LCSC; Supplier Part: C428721; Manufacturer Part: XT30UPB-M; JLCPCB Part Class: Extended Part; Add into BOM: yes; Origin Footprint: CONN-TH_XT30UPB-M
D3 = SS54B: Manufacturer: PINGWEI(平伟); Convert to PCB: yes; Name: SS54B; Symbol: SS54B; Device: SS54B; Supplier: LCSC; Supplier Part: C360458; Manufacturer Part: SS54B; JLCPCB Part Class: Extended Part; Add into BOM: yes; Origin Footprint: DO-214BA_L4.8-W2.9-LS5.3-RD
D4-D6 = SD103AWS: Manufacturer: 星海; Convert to PCB: yes; Name: SD103AWS; Symbol: SD103AWS; Device: SD103AWS; Supplier: LCSC; Supplier Part: C146260; Manufacturer Part: SD103AWS; JLCPCB Part Class: Extended Part; Add into BOM: yes; Origin Footprint: SOD-323_L1.8-W1.3-LS2.5-RD
D7 = PRTR5V0U2X: Manufacturer: Yenji Elec; Convert to PCB: yes; Name: PRTR5V0U2X; Symbol: PRTR5V0U2X; Device: PRTR5V0U2X; Supplier: LCSC; Supplier Part: C330092; Manufacturer Part: PRTR5V0U2X; Add into BOM: yes; Origin Footprint: SOT-143_L2.9-W1.3-P1.92-LS2.3-BL
L1 = BLM18SG121TN1D: Manufacturer: muRata(村田); Convert to PCB: yes; Name: BLM18SG121TN1D; Symbol: BLM18SG121TN1D; Device: BLM18SG121TN1D; Supplier: LCSC; Supplier Part: C113030; Manufacturer Part: BLM18SG121TN1D; JLCPCB Part Class: Extended Part; Add into BOM: yes; Origin Footprint: L0603
L2 = 10uH: Manufacturer: Sunlord(顺络); Manufacturer Part: MPL2520S100MWT; Convert to PCB: yes; Name: 10uH; Symbol: 10uH; Device: 10uH; Supplier: LCSC; Supplier Part: C370039; JLCPCB Part Class: Extended Part; Add into BOM: yes; Origin Footprint: L1008
L3 = PSPNAQ252012-2R2M: Convert to PCB: yes; Name: PSPNAQ252012-2R2M; Symbol: PSPNAQ252012-2R2M; Device: PSPNAQ252012-2R2M; Add into BOM: yes; Origin Footprint: L2520
LED11 = KT-0603R: Manufacturer: KENTO; Convert to PCB: yes; Name: KT-0603R; Symbol: KT-0603R; Device: KT-0603R; Supplier: LCSC; Manufacturer Part: KT-0603R; Supplier Part: C2286; JLCPCB Part Class: Basic Part; Add into BOM: yes; Origin Footprint: LED0603-RD
LED12 = 19-213/Y2C-CQ2R2L/3T(CY): as LED4 on sheet 2_02 Peripherals.SchDoc; Name: 19-213/Y2C-CQ2R2L/3T(CY); Symbol: 19-213/Y2C-CQ2R2L/3T(CY); Device: 19-213/Y2C-CQ2R2L/3T(CY); Supplier: LCSC; Manufacturer Part: 19-213/Y2C-CQ2R2L/3T(CY); Supplier Part: C72038; JLCPCB Part Class: Basic Part; Add into BOM: yes; Origin Footprint: LED0603-RD-YELLOW
Q1 Q2 Q5 Q6 = AO3401: Manufacturer: Hottech(合科泰); Convert to PCB: yes; Name: AO3401; Symbol: AO3401; Device: AO3401; Supplier: LCSC; Manufacturer Part: AO3401; Supplier Part: C181091; JLCPCB Part Class: Extended Part; Add into BOM: yes; Origin Footprint: SOT-23-3_L2.9-W1.3-P1.90-LS2.4-BR
Q3 Q4 = 2SK3541: Manufacturer: CJ（江苏长电/长晶）; Convert to PCB: yes; Name: 2SK3541; Symbol: 2SK3541; Device: 2SK3541; Supplier: LCSC; Supplier Part: C504051; Manufacturer Part: 2SK3541; JLCPCB Part Class: Extended Part; Add into BOM: yes; Origin Footprint: SOT-723_L1.2-W0.8-P0.40-LS1.2-BR
R37 R41-R43 R48 R51 = 100k/0402/1%: Convert to PCB: yes; Name: 100k/0402/1%; Symbol: 100k/0402/1%; Device: 100k/0402/1%; Add into BOM: yes; Origin Footprint: R0402
R38 = 7.68K/0402/1%: Convert to PCB: yes; Name: 7.68K/0402/1%; Symbol: 7.68K/0402/1%; Device: 7.68K/0402/1%; Add into BOM: yes; Origin Footprint: R0402
R39 = 10R/0402/1%: Convert to PCB: yes; Name: 10R/0402/1%; Symbol: 10R/0402/1%; Device: 10R/0402/1%; Add into BOM: yes; Origin Footprint: R0402
R40 = 10R/0402/1%-NC: Convert to PCB: yes; Name: 10R/0402/1%-NC; Symbol: 10R/0402/1%-NC; Device: 10R/0402/1%-NC; Add into BOM: yes; Origin Footprint: R0402
R44 = 470R/0402/1%: Convert to PCB: yes; Name: 470R/0402/1%; Symbol: 470R/0402/1%; Device: 470R/0402/1%; Add into BOM: yes; Origin Footprint: R0402
R45 = 40.2K/0402/1%: Convert to PCB: yes; Name: 40.2K/0402/1%; Symbol: 40.2K/0402/1%; Device: 40.2K/0402/1%; Add into BOM: yes; Origin Footprint: R0402
R46 R47 = 10k/0402/1%: Convert to PCB: yes; Name: 10k/0402/1%; Symbol: 10k/0402/1%; Device: 10k/0402/1%; Add into BOM: yes; Origin Footprint: R0402
R49 R50 = 10K/0402/1%: Convert to PCB: yes; Name: 10K/0402/1%; Symbol: 10K/0402/1%; Device: 10K/0402/1%; Published: 8-Jun-2000; LatestRevisionDate: 17-Jul-2002; LatestRevisionNote: Re-released for DXP Platform.; PackageReference: AXIAL-0.5; Publisher: Altium Limited; PackageDescription: Axial Device, Thru-Hole; 2 Leads; 0.5 in Pin Spacing; Add into BOM: yes; Origin Footprint: R0402
R52 = 22.1K/0402/1%: Convert to PCB: yes; Name: 22.1K/0402/1%; Symbol: 22.1K/0402/1%; Device: 22.1K/0402/1%; Add into BOM: yes; Origin Footprint: R0402
U15 = LGS5145: Manufacturer: Legend-Si(棱晶半导体); Convert to PCB: yes; Name: LGS5145; Symbol: LGS5145; Device: LGS5145; Supplier: LCSC; Supplier Part: C5123971; Manufacturer Part: LGS5145; link: https://atta.szlcsc.com/upload/public/pdf/source/20220805/2DB5B167BD44FCFE8FA85A20D08C0087.pdf; JLCPCB Part Class: Extended Part; Add into BOM: yes; Origin Footprint: SOT-23-6_L2.9-W1.7-P0.95-LS2.8-BL
U16 = SY8088IAAC: Manufacturer: silergy(矽力杰); Convert to PCB: yes; Name: SY8088IAAC; Symbol: SY8088IAAC; Device: SY8088IAAC; Supplier: LCSC; Supplier Part: C479072; Manufacturer Part: SY8088IAAC; JLCPCB Part Class: Extended Part; Add into BOM: yes; Origin Footprint: SOT-23-5_L3.0-W1.7-P0.95-LS2.8-BL
USB1 = micro USBFemale: Manufacturer: ValuePro; Convert to PCB: yes; Name: micro USBFemale; Symbol: micro USBFemale; Device: micro USBFemale; Supplier: LCSC; Manufacturer Part: micro USBFemale; Supplier Part: C10418; JLCPCB Part Class: Extended Part; Add into BOM: yes; Origin Footprint: MICRO-USB-SMD_5P-P0.65-H-F_C10418

## Nets that join several sheets
#EXPC1: 1_01 MCU.SchDoc (U1.24), 2_02 Peripherals.SchDoc (R24.2 U11.6)
#EXPC2: 1_01 MCU.SchDoc (U1.29), 2_02 Peripherals.SchDoc (R22.2 U11.4)
#EXPC3: 1_01 MCU.SchDoc (U1.30), 2_02 Peripherals.SchDoc (R23.2 U12.6)
GND: 1_01 MCU.SchDoc (30 pins), 2_02 Peripherals.SchDoc (73 pins), 3_03 Power.SchDoc (24 pins)
PA02_AIN0: 1_01 MCU.SchDoc (U1.3), 2_02 Peripherals.SchDoc (U5.1 U5.3)
PA04_AIN4: 1_01 MCU.SchDoc (U1.9), 2_02 Peripherals.SchDoc (CN17.2 CN20.2)
PA05_AIN5: 1_01 MCU.SchDoc (U1.10), 2_02 Peripherals.SchDoc (CN17.3 CN20.3)
PA06_DGI_GPIO2: 1_01 MCU.SchDoc (U1.11), 2_02 Peripherals.SchDoc (CN15.4 CN18.5)
PA07_DGI_GPIO3: 1_01 MCU.SchDoc (U1.12), 2_02 Peripherals.SchDoc (CN15.5 CN18.6)
PA08_TCC0-W4: 1_01 MCU.SchDoc (U1.13), 2_02 Peripherals.SchDoc (CN5.1 CN6.3 R28.2 U14.2)
PA09_TCC0-W1: 1_01 MCU.SchDoc (U1.14), 2_02 Peripherals.SchDoc (CN6.2 R26.2 U14.10)
PA10_TCC0-W2: 1_01 MCU.SchDoc (U1.15), 2_02 Peripherals.SchDoc (CN17.4 CN20.4)
PA11_TCC0-W3: 1_01 MCU.SchDoc (U1.16), 2_02 Peripherals.SchDoc (CN5.3 CN6.5)
PA12_S4_SPI_MISO: 1_01 MCU.SchDoc (U1.21), 2_02 Peripherals.SchDoc (CN16.2 CN19.3)
PA13_GPIO: 1_01 MCU.SchDoc (U1.22), 2_02 Peripherals.SchDoc (CN16.5 CN19.6)
PA14_TCC0-W0: 1_01 MCU.SchDoc (U1.23), 2_02 Peripherals.SchDoc (CN7.3 CN8.5)
PA16_S1_MOSI: 1_01 MCU.SchDoc (U1.25), 2_02 Peripherals.SchDoc (CN15.3 CN18.4)
PA17_S1_SCK: 1_01 MCU.SchDoc (U1.26), 2_02 Peripherals.SchDoc (CN15.1 CN18.2)
PA18_S1_SS: 1_01 MCU.SchDoc (U1.27), 2_02 Peripherals.SchDoc (CN16.4 CN19.5)
PA19_S1_MISO: 1_01 MCU.SchDoc (U1.28), 2_02 Peripherals.SchDoc (CN15.2 CN18.3)
PA24_USB_DM: 1_01 MCU.SchDoc (U1.33), 3_03 Power.SchDoc (D7.3 USB1.2)
PA25_USB_DP: 1_01 MCU.SchDoc (U1.34), 3_03 Power.SchDoc (D7.2 USB1.3)
PA27_GPIO: 1_01 MCU.SchDoc (U1.39), 2_02 Peripherals.SchDoc (CN17.1 CN20.1)
PA28_USB_HOST_EN: 1_01 MCU.SchDoc (U1.41), 3_03 Power.SchDoc (D4.2)
PB08_AIN2: 1_01 MCU.SchDoc (U1.8), 2_02 Peripherals.SchDoc (U6.3)
PB09_AIN3: 1_01 MCU.SchDoc (U1.7), 2_02 Peripherals.SchDoc (U7.3)
PB10_S4_SPI_MOSI: 1_01 MCU.SchDoc (U1.19), 2_02 Peripherals.SchDoc (CN16.3 CN19.4)
PB11_S4_SPI_SCK: 1_01 MCU.SchDoc (U1.20), 2_02 Peripherals.SchDoc (CN16.1 CN19.2)
PB22_S5_TX: 1_01 MCU.SchDoc (U1.37), 2_02 Peripherals.SchDoc (CN7.1 CN8.3 R27.2 U13.2)
PB23_S5_RX: 1_01 MCU.SchDoc (U1.38), 2_02 Peripherals.SchDoc (CN8.2 R25.2 U13.10)
VCC_3V3: 1_01 MCU.SchDoc (17 pins), 2_02 Peripherals.SchDoc (26 pins), 3_03 Power.SchDoc (7 pins)
VCC_5V: 1_01 MCU.SchDoc (CN1.1 CN3.1), 2_02 Peripherals.SchDoc (7 pins), 3_03 Power.SchDoc (7 pins)